# EAGLE design karmacontroller (EAGLE 6.4)
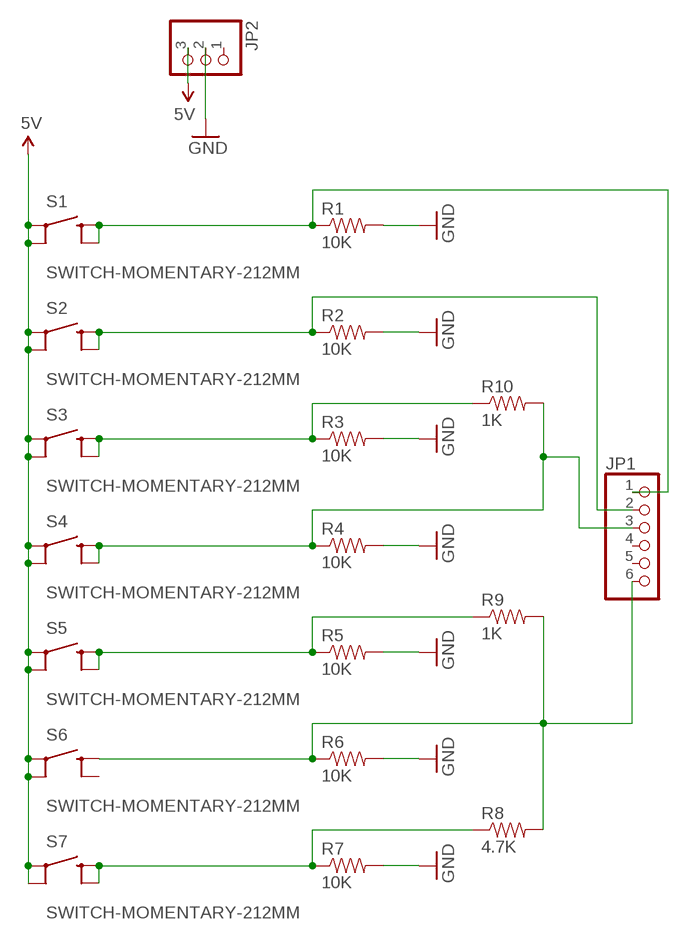
[diagram p0: schematic, sheet 1]

## Parts
JP1  PINHD-1X6  [1X06]
JP2  PINHD-1X3  [1X03]
R1  10K  RESISTORAXIAL-0.3  [AXIAL-0.3]
R2  10K  RESISTORAXIAL-0.3  [AXIAL-0.3]
R3  10K  RESISTORAXIAL-0.3  [AXIAL-0.3]
R4  10K  RESISTORAXIAL-0.3  [AXIAL-0.3]
R5  10K  RESISTORAXIAL-0.3  [AXIAL-0.3]
R6  10K  RESISTORAXIAL-0.3  [AXIAL-0.3]
R7  10K  RESISTORAXIAL-0.3  [AXIAL-0.3]
R8  4.7K  RESISTORAXIAL-0.3  [AXIAL-0.3]
R9  1K  RESISTORAXIAL-0.3  [AXIAL-0.3]
R10  1K  RESISTORAXIAL-0.3  [AXIAL-0.3]
S1  SWITCH-MOMENTARY-212MM  [TACTILE-PTH-12MM]
S2  SWITCH-MOMENTARY-212MM  [TACTILE-PTH-12MM]
S3  SWITCH-MOMENTARY-212MM  [TACTILE-PTH-12MM]
S4  SWITCH-MOMENTARY-212MM  [TACTILE-PTH-12MM]
S5  SWITCH-MOMENTARY-212MM  [TACTILE-PTH-12MM]
S6  SWITCH-MOMENTARY-212MM  [TACTILE-PTH-12MM]
S7  SWITCH-MOMENTARY-212MM  [TACTILE-PTH-12MM]

## Nets
5V: JP2.3 S1.1 S1.2(1') S2.1 S2.2(1') S3.1 S3.2(1') S4.1 S4.2(1') S5.1 S5.2(1') S6.1 S6.2(1') S7.1 S7.2(1')
DOWN: R7.P$1 R8.P$1 S7.3 S7.4(2')
GND: JP2.2 R1.P$2 R2.P$2 R3.P$2 R4.P$2 R5.P$2 R6.P$2 R7.P$2
N$1: JP1.2 R2.P$1 S2.3 S2.4(2')
N$2: JP1.1 R1.P$1 S1.3 S1.4(2')
N$4: JP1.3 R4.P$1 R10.P$2 S4.3 S4.4(2')
N$5: R5.P$1 R9.P$1 S5.3 S5.4(2')
N$6: JP1.6 R6.P$1 R8.P$2 R9.P$2 S6.3
N$7: R3.P$1 R10.P$1 S3.3 S3.4(2')
Unconnected: JP1.4 JP1.5 JP2.1 S6.4(2')

## Library data of the parts
JP1 = adafruit:PINHD-1X6: PIN HEADER
JP2 = adafruit:PINHD-1X3: PIN HEADER
R1-R10 = SparkFun-Resistors:RESISTOR: Resistor Basic schematic elements and footprints for 0603, 1206, and PTH resistors.
S1-S7 = SparkFun-Electromechanical:SWITCH-MOMENTARY-2: Various NO switches- pushbuttons, reed, etc

## Net classes
0 default: clearance 0.355 mm

## Board
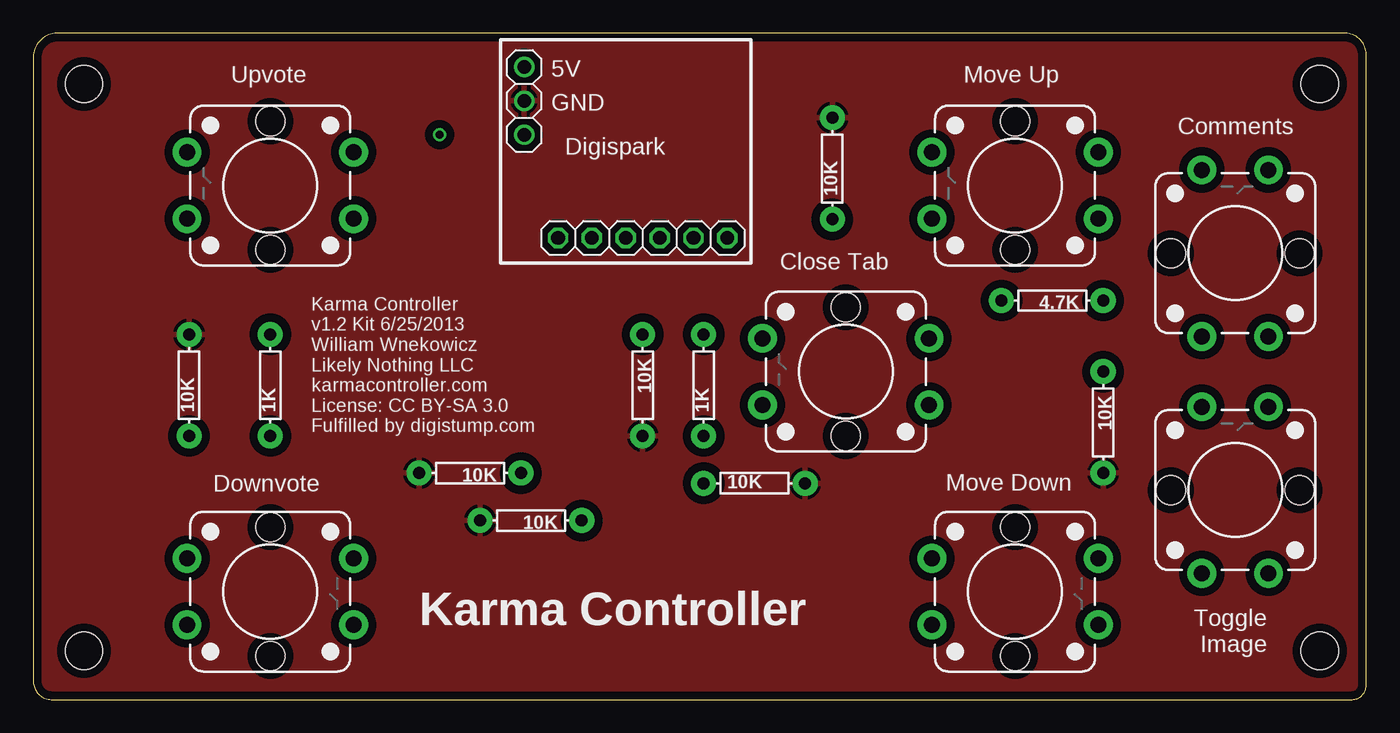
[diagram p1: board, top side]
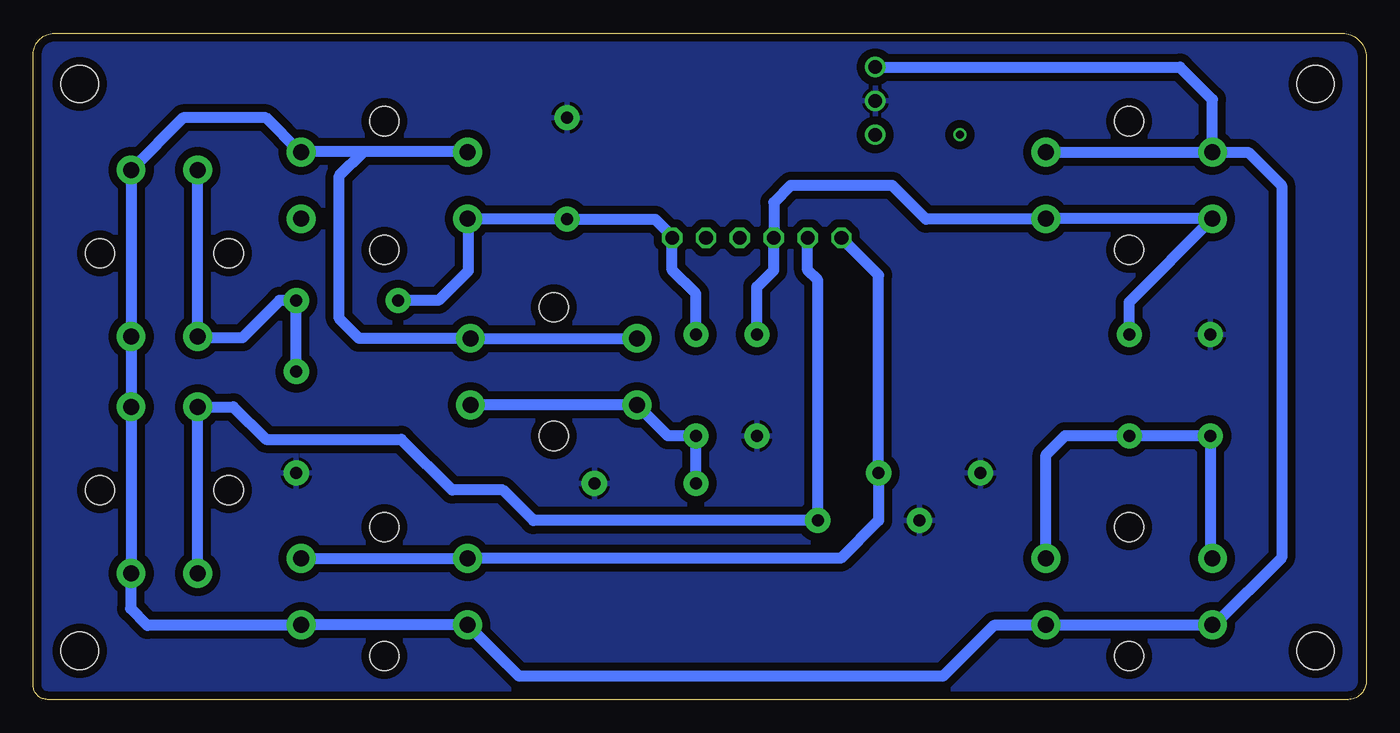
[diagram p2: board, bottom side, seen from below]

Size 100 x 50 mm. Coordinates in mm from the lower left corner, seen from the top.
Outline: 1.36,0 98.94,0 arc90 100,1.05 100,48.43 arc90 98.43,50 1.79,50 arc90 0,48.21 0,1.36 arc90 1.36,0
Copper layers (1*16): Top 0.0356mm / dielectric 1.5011mm / Bottom 0.0356mm
Design rules "LaenPCBOrder *": minimum track width 6mil, minimum drill 13mil, track to track 6mil, track to pad 6mil, pad to pad 6mil, via to via 6mil, smd to smd 6mil, copper to edge 15mil, drill to drill 6mil, minimum pad ring 7mil, minimum via ring 7mil, stop-mask expansion 4mil, vias tented up to drill 25mm, thermal gap 10mil
Holes 2.8 mm at 3.81,46.2 96.52,46.2 96.52,3.66 3.81,3.66
Holes 2.2 mm at 17.78,12.93 17.78,3.27 17.78,43.41 17.78,33.75 60.96,19.78 60.96,29.44 73.66,43.41 73.66,33.75 85.34,33.5 95,33.5 85.34,15.72 95,15.72 73.66,12.93 73.66,3.27

### Footprints (pad centres in the part's own frame; a part is rotated, then mirrored left to right if it is on the bottom)
1X06 = drill 1.016 octagon: 1 -6.35,0; 2 -3.81,0; 3 -1.27,0; 4 1.27,0; 5 3.81,0; 6 6.35,0
1X03 = drill 1.016: 1 -2.54,0; 2 0,0; 3 2.54,0
AXIAL-0.3 = drill 0.9 pad 1.88: P$1 -3.81,0; P$2 3.81,0
TACTILE-PTH-12MM = drill 1.2 pad 2.159: 1 6.25,-2.5; 2 -6.25,-2.5; 3 6.25,2.5; 4 -6.25,2.5

### Placement (x,y rotation side)
JP1  45.72,34.64 0 top
JP2  36.83,44.93 90 top
R1  32.77,16.99 180 top
R2  37.34,13.43 180 top
R3  11.68,23.59 90 top
R4  45.72,23.59 270 top
R5  54.1,16.23 0 top
R6  59.94,39.85 90 top
R7  80.26,20.8 270 top
R8  76.45,29.94 180 top
R9  50.29,23.59 90 top
R10  17.78,23.59 90 top
S1  73.66,8.1 0 top
S2  90.17,15.72 90 top
S3  17.78,8.1 0 top
S4  17.78,38.58 180 top
S5  60.96,24.61 180 top
S6  73.66,38.58 180 top
S7  90.17,33.5 90 top

### Tracks (layer width: path | path; a pad name or v marks a point on that pad's centre or on a via)
5V
  Bottom 0.813: JP2.3 13.97,47.47 11.53,45.03 S4.1 | 24.13,5.56 24.07,5.56 | 24.07,5.56 23.99,5.56 | 11.43,5.56 S3.2 | 24.13,5.56 S3.1 | 67.31,5.56 S1.2 | 75.23,41.12 67.31,41.12 S6.1 | 75.23,41.12 80.01,41.12 | 80.01,41.12 S6.2 | 80.01,41.12 82.55,43.66 88.76,43.66 S7.1 S7.2 S2.1 S2.2 92.71,9.37 92.71,6.83 91.44,5.56 80.01,5.56 S1.1 S1.2 | S5.1 S5.2 75.56,27.11 77.05,28.6 77.05,39.3 75.23,41.12 | 11.43,5.56 6.35,10.64 6.35,38.58 8.85,41.08 S4.1 | 11.43,5.56 23.99,5.56 | 23.99,5.56 S3.1 | 24.07,5.56 S3.1 | 24.13,5.56 27.94,5.56 31.75,1.75 63.56,1.75 S1.2 | S4.2 S4.1
DOWN
  Bottom 0.813: S7.3 S7.4 87.57,27.15 84.33,27.15 81.53,29.94 R8.P$1 R7.P$1
GND
  pour Bottom (isolate 0.61): 0,0.48 0,50.01 100.33,50.01 100.33,0.48
  pour Top (isolate 0.61): 0,0.48 0,50.01 100.33,50.01 100.33,0.48
N$1
  Bottom 0.813: S2.4 S2.3 84.99,21.97 82.55,19.53 72.39,19.53 68.58,15.72 64.77,15.72 62.48,13.43 R2.P$1 41.15,31.47 41.91,32.23 JP1.2
N$2
  Bottom 0.813: JP1.1 36.58,31.85 R1.P$1 36.58,13.43 39.41,10.6 S1.4 S1.3
N$3  (via drill 0.6)
  other vias: 30.48,42.39
N$4
  Bottom 0.813: R10.P$2 17.78,29.83 S4.3 S4.4 24.07,36.04 33.02,36.04 35.56,38.58 43.18,38.58 44.45,37.31 JP1.3 44.45,32.23 45.72,30.96 R4.P$1
N$5
  Bottom 0.813: S5.4 S5.3 52.38,19.78 R9.P$1 R5.P$1
N$6
  Bottom 0.813: R9.P$2 50.29,30.45 52.07,32.23 JP1.6 52.07,34.77 53.34,36.04 R6.P$1 67.37,36.04 | 67.37,36.04 S6.3 | 67.37,36.04 67.37,32.17 69.6,29.94 R8.P$2
N$7
  Bottom 0.813: S3.3 24.03,18.36 22.61,19.78 R10.P$1 R3.P$1 11.68,10.75 S3.4

### Text on the board
tPlace: Digispark
_tsilk: 5V | Upvote | Move Up | GND | Comments | Close Tab | Karma Controller / v1.2 Kit 6/25/2013 / William Wnekowicz / Likely Nothing LLC / karmacontroller.com / License: CC BY-SA 3.0 / Fulfilled by digistump.com | Downvote | Move Down | Karma Controller | Toggle | Image